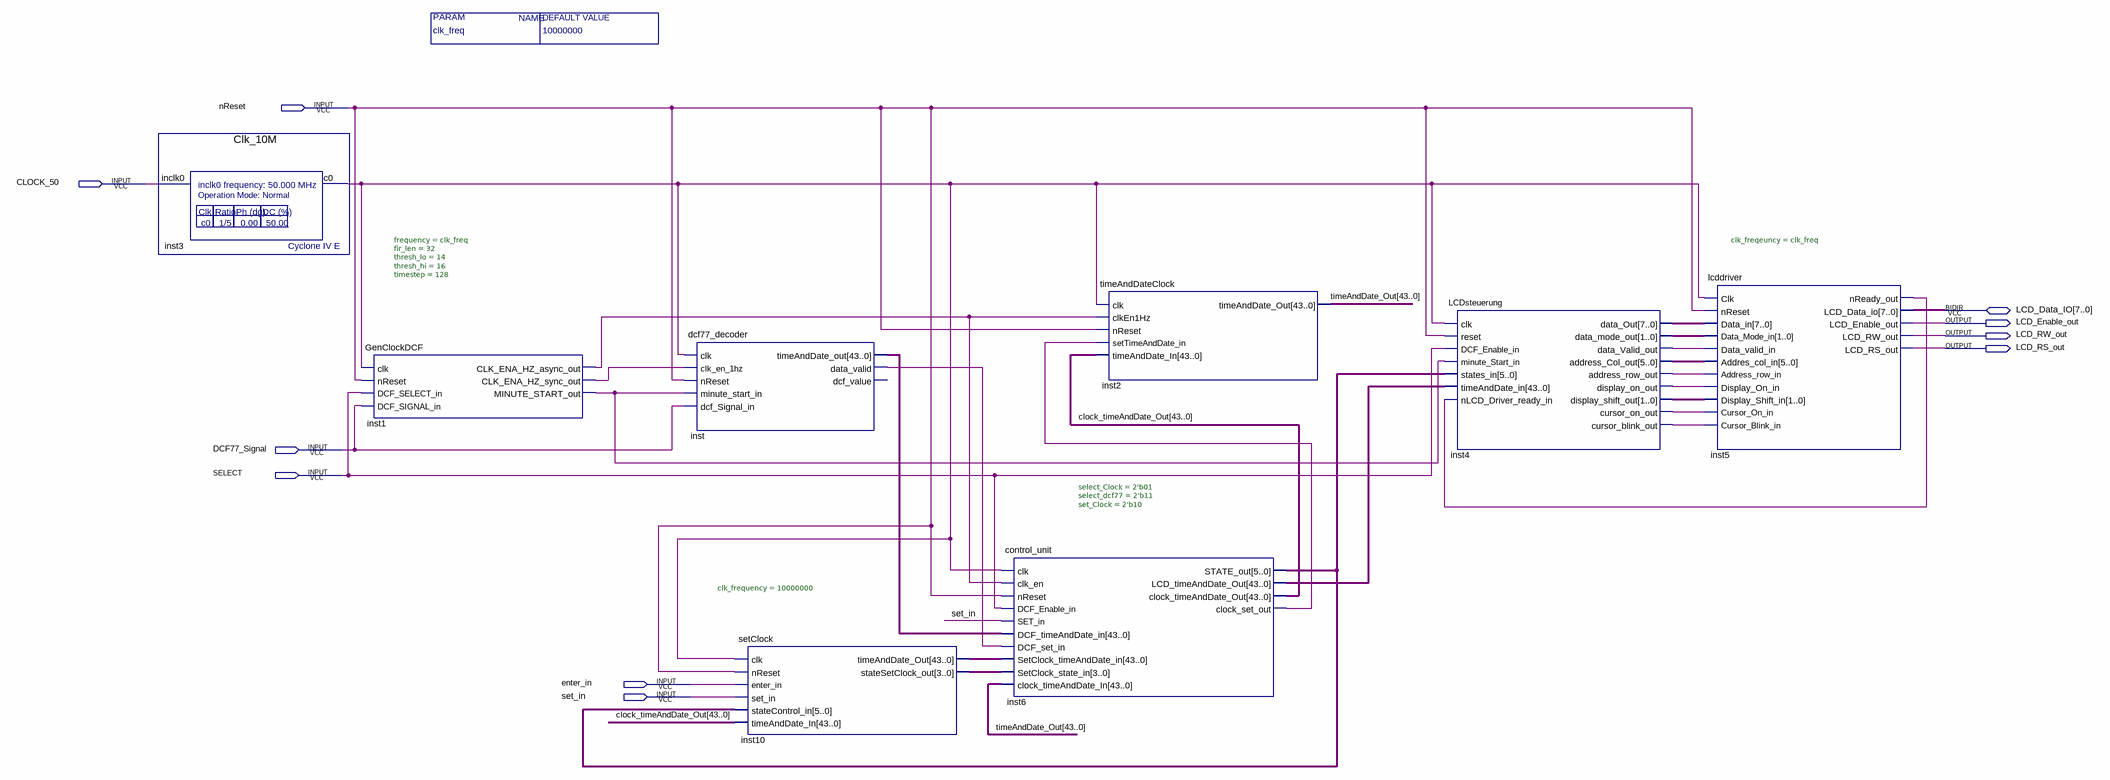
[diagram p0: schematic sheet]
// Quartus schematic Clcokwork_ex5.bdf as structural Verilog: 8 symbols, 10 pins
module Clcokwork_ex5 #(parameter clk_freq = 10000000) (
  input  nReset,
  input  CLOCK_50,
  input  DCF77_Signal,
  input  SELECT,
  input  enter_in,
  input  set_in,
  inout  [7:0] LCD_Data_IO,
  output LCD_Enable_out,
  output LCD_RW_out,
  output LCD_RS_out
);

  wire inst1_clk_ena_hz_async_out, inst1_clk_ena_hz_sync_out, inst1_minute_start_out, inst3_c0,
       inst4_address_row_out, inst4_cursor_blink_out, inst4_cursor_on_out, inst4_data_valid_out,
       inst4_display_on_out, inst5_nready_out, inst6_clock_set_out, inst_data_valid;
  wire [1:0] inst4_data_mode_out, inst4_display_shift_out;
  wire [3:0] inst10_statesetclock_out;
  wire [5:0] inst4_address_col_out, inst6_state_out;
  wire [7:0] inst4_data_out;
  wire [43:0] clock_timeAndDate_Out, inst6_lcd_timeanddate_out, inst10_timeanddate_out, inst_timeanddate_out,
       timeAndDate_Out;

  Clk_10M inst3 (.inclk0(CLOCK_50), .c0(inst3_c0));
  GenClockDCF #(.frequency(clk_freq), .fir_len(32), .thresh_lo(14), .thresh_hi(16), .timestep(128)) inst1 (
    .clk(inst3_c0), .nReset(nReset), .DCF_SELECT_in(SELECT), .DCF_SIGNAL_in(DCF77_Signal),
    .CLK_ENA_HZ_async_out(inst1_clk_ena_hz_async_out), .CLK_ENA_HZ_sync_out(inst1_clk_ena_hz_sync_out),
    .MINUTE_START_out(inst1_minute_start_out));
  dcf77_decoder inst (
    .clk(inst3_c0), .clk_en_1hz(inst1_clk_ena_hz_sync_out), .nReset(nReset),
    .minute_start_in(inst1_minute_start_out), .dcf_Signal_in(DCF77_Signal),
    .timeAndDate_out(inst_timeanddate_out), .data_valid(inst_data_valid));  // open: dcf_value
  setClock #(.clk_frequency(10000000)) inst10 (
    .clk(inst3_c0), .nReset(nReset), .enter_in(enter_in), .set_in(set_in), .stateControl_in(inst6_state_out),
    .timeAndDate_In(clock_timeAndDate_Out), .timeAndDate_Out(inst10_timeanddate_out),
    .stateSetClock_out(inst10_statesetclock_out));
  control_unit #(.select_Clock(2'b01), .select_dcf77(2'b11), .set_Clock(2'b10)) inst6 (
    .clk(inst3_c0), .clk_en(inst1_clk_ena_hz_async_out), .nReset(nReset), .DCF_Enable_in(SELECT),
    .SET_in(set_in), .DCF_timeAndDate_in(inst_timeanddate_out), .DCF_set_in(inst_data_valid),
    .SetClock_timeAndDate_in(inst10_timeanddate_out), .SetClock_state_in(inst10_statesetclock_out),
    .clock_timeAndDate_In(timeAndDate_Out), .STATE_out(inst6_state_out),
    .LCD_timeAndDate_Out(inst6_lcd_timeanddate_out), .clock_timeAndDate_Out(clock_timeAndDate_Out),
    .clock_set_out(inst6_clock_set_out));
  timeAndDateClock inst2 (
    .clk(inst3_c0), .clkEn1Hz(inst1_clk_ena_hz_async_out), .nReset(nReset),
    .setTimeAndDate_in(inst6_clock_set_out), .timeAndDate_In(clock_timeAndDate_Out),
    .timeAndDate_Out(timeAndDate_Out));
  LCDsteuerung inst4 (
    .clk(inst3_c0), .reset(nReset), .DCF_Enable_in(SELECT), .minute_Start_in(inst1_minute_start_out),
    .states_in(inst6_state_out), .timeAndDate_in(inst6_lcd_timeanddate_out),
    .nLCD_Driver_ready_in(inst5_nready_out), .data_Out(inst4_data_out), .data_mode_out(inst4_data_mode_out),
    .data_Valid_out(inst4_data_valid_out), .address_Col_out(inst4_address_col_out),
    .address_row_out(inst4_address_row_out), .display_on_out(inst4_display_on_out),
    .display_shift_out(inst4_display_shift_out), .cursor_on_out(inst4_cursor_on_out),
    .cursor_blink_out(inst4_cursor_blink_out));
  lcddriver #(.clk_freqeuncy(clk_freq)) inst5 (
    .Clk(inst3_c0), .nReset(nReset), .Data_in(inst4_data_out), .Data_Mode_in(inst4_data_mode_out),
    .Data_valid_in(inst4_data_valid_out), .Addres_col_in(inst4_address_col_out),
    .Address_row_in(inst4_address_row_out), .Display_On_in(inst4_display_on_out),
    .Display_Shift_in(inst4_display_shift_out), .Cursor_On_in(inst4_cursor_on_out),
    .Cursor_Blink_in(inst4_cursor_blink_out), .nReady_out(inst5_nready_out), .LCD_Enable_out(LCD_Enable_out),
    .LCD_RW_out(LCD_RW_out), .LCD_RS_out(LCD_RS_out), .LCD_Data_io(LCD_Data_IO));
endmodule
